# Altium schematic sheet mainboard.SchDoc
size A3; Organization: Altium Limited; Address1: L3, 12a Rodborough Rd; Address2: Frenchs Forest; Address3: NSW; Address4: Australia 2086
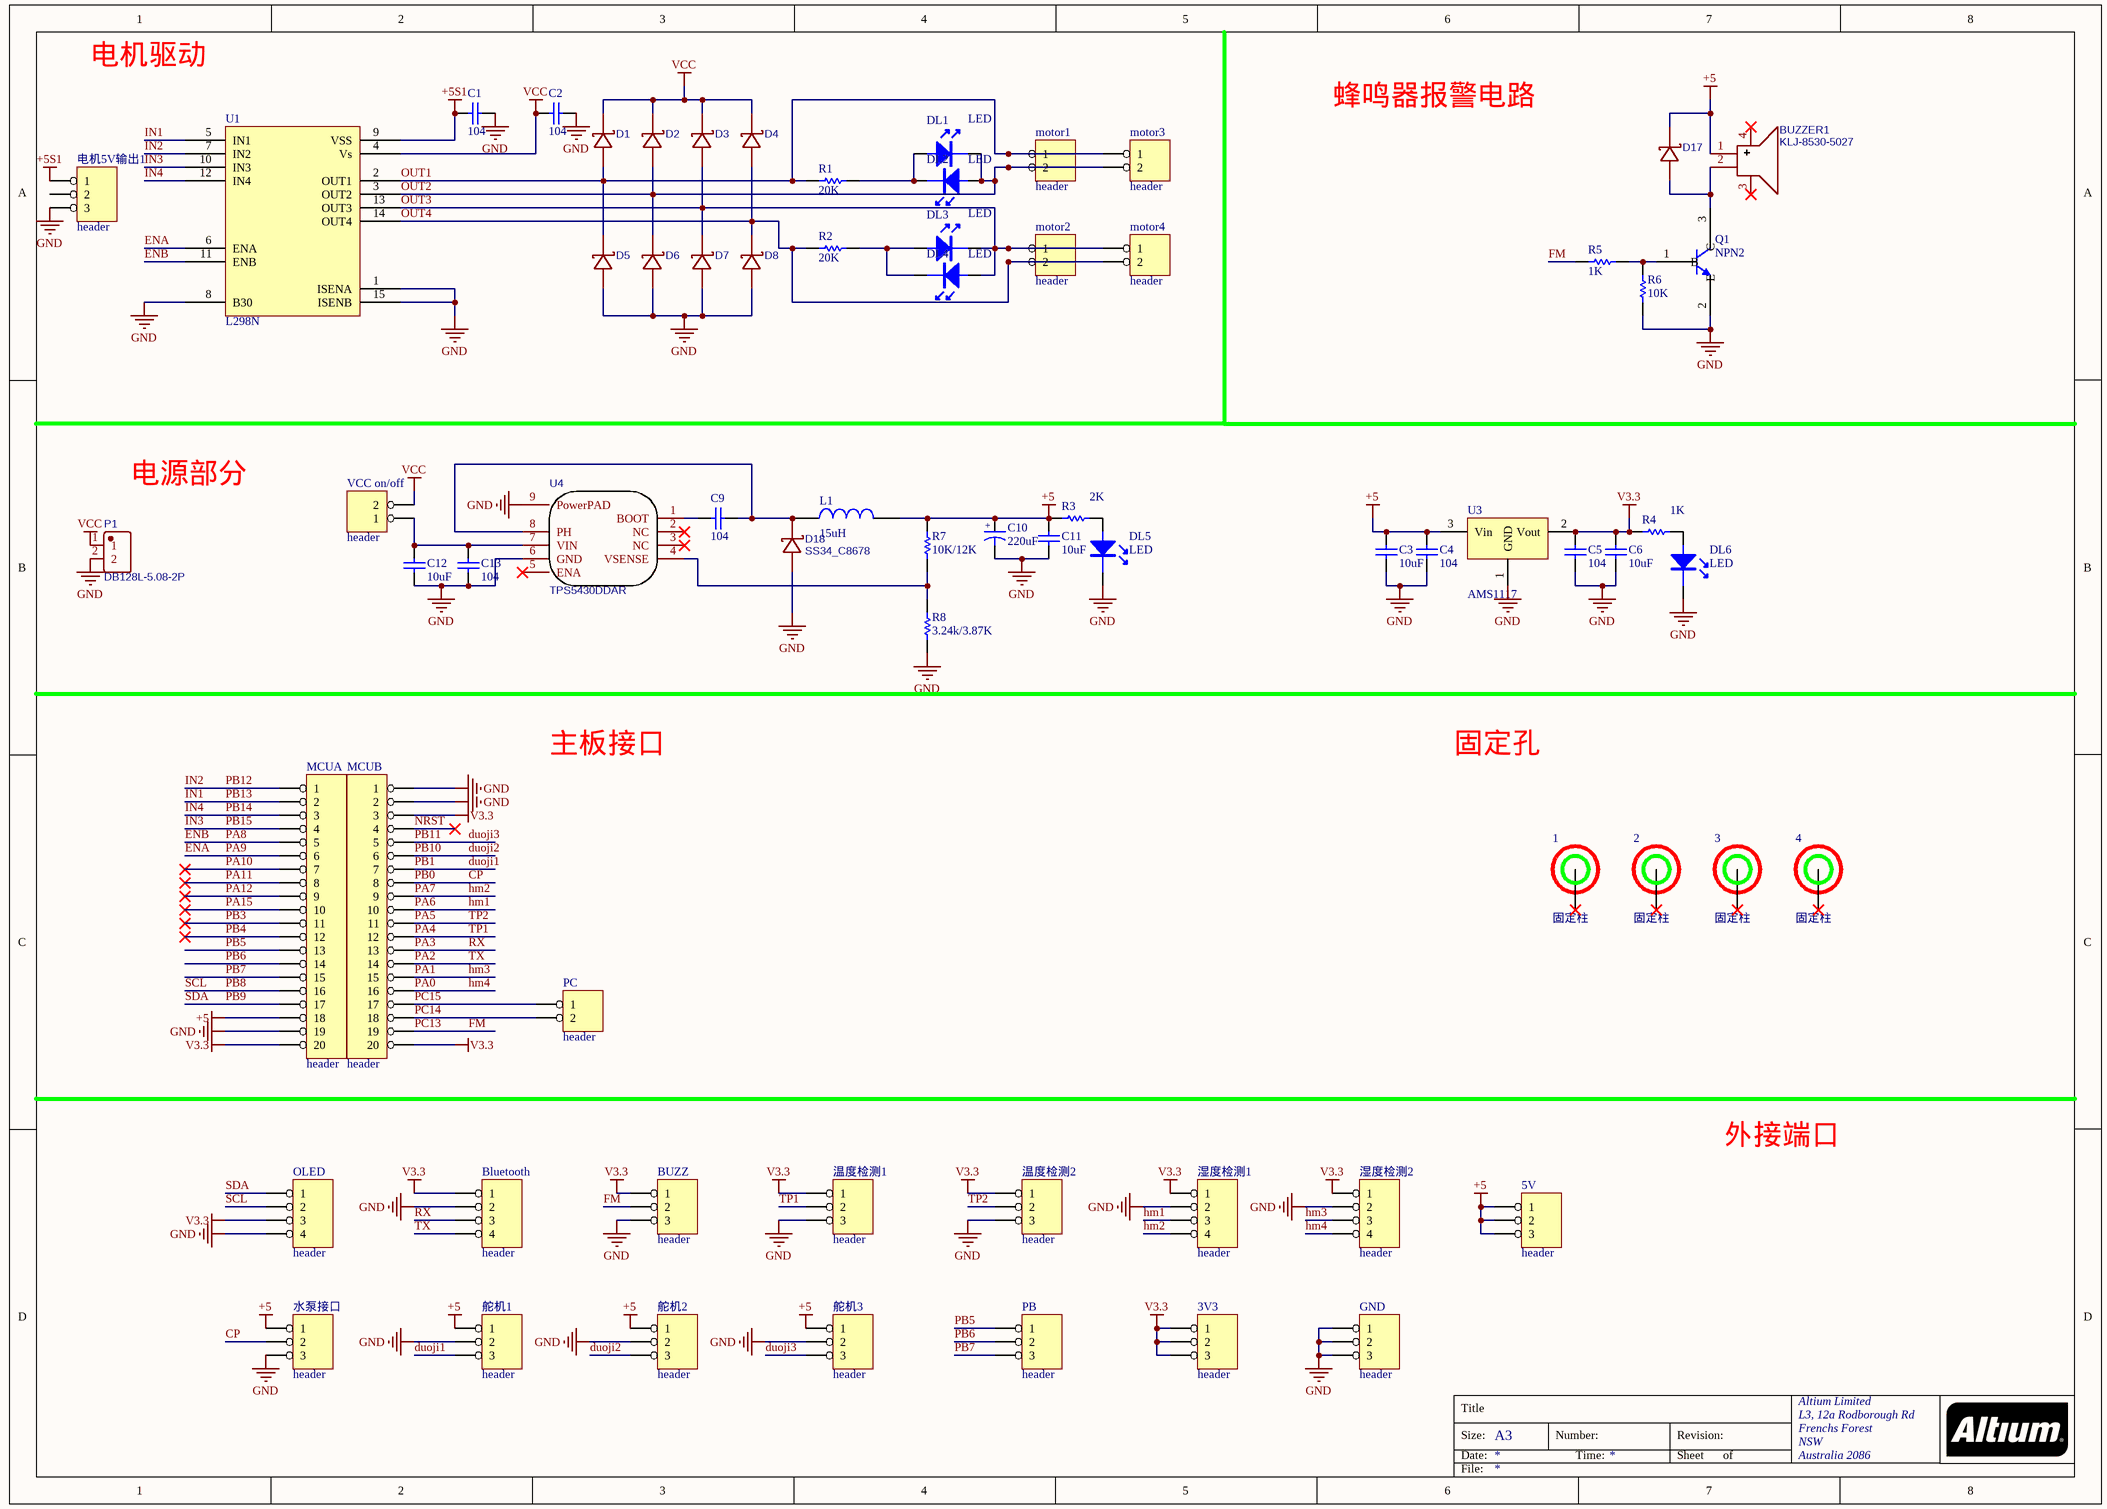
[diagram p0: mainboard.SchDoc]

## Parts
1  固定柱  [M3x4+6_L]
2  固定柱  [M3x4+6_L]
3  固定柱  [M3x4+6_L]
3V3  header  [header3]
4  固定柱  [M3x4+6_L]
5V  header  [header3]
Bluetooth  header  [header4]
BUZZ  header  [header3]
BUZZER1  KLJ-8530-5027  [BUZ-SMD_4P-L8.5-W8.5-TL]
C1  104  [0603_C]
C2  104  [0603_C]
C3  10uF  [0603_C]
C4  104  [0603_C]
C5  104  [0603_C]
C6  10uF  [0603_C]
C9  104  [0603_C]
C10  220uF  [CD7]
C11  10uF  [0805_c]
C12  10uF  [0805_c]
C13  104  [0603_C]
D1  (no value)  [DO-214AC_L4.3-W2.7-LS5.3-RD]
D2  (no value)  [DO-214AC_L4.3-W2.7-LS5.3-RD]
D3  (no value)  [DO-214AC_L4.3-W2.7-LS5.3-RD]
D4  (no value)  [DO-214AC_L4.3-W2.7-LS5.3-RD]
D5  (no value)  [DO-214AC_L4.3-W2.7-LS5.3-RD]
D6  (no value)  [DO-214AC_L4.3-W2.7-LS5.3-RD]
D7  (no value)  [DO-214AC_L4.3-W2.7-LS5.3-RD]
D8  (no value)  [DO-214AC_L4.3-W2.7-LS5.3-RD]
D17  (no value)  [DO-214AC_L4.3-W2.7-LS5.3-RD]
D18  SS34_C8678  [DO-214AC_L4.3-W2.7-LS5.3-RD]
DL1  LED  [0805_LED]
DL2  LED  [0805_LED]
DL3  LED  [0805_LED]
DL4  LED  [0805_LED]
DL5  LED  [0805_LED]
DL6  LED  [0805_LED]
GND  header  [header3]
L1  15uH  [CD75]
MCUA  header  [header20]
MCUB  header  [header20]
motor1  header  [header2]
motor2  header  [header2]
motor3  header  [header2]
motor4  header  [header2]
OLED  header  [header4]
P1  DB128L-5.08-2P  [CONN-TH_2P-P5.08_DB128L-5.08-2P]
PB  header  [header3]
PC  header  [header2]
Q1  NPN2  [SOT-23-3]
R1  20K  [0603_R]
R2  20K  [0603_R]
R3  2K  [0805_r]
R4  1K  [0805_r]
R5  1K  [0805_r]
R6  10K  [0805_r]
R7  10K/12K  [0805_r]
R8  3.24k/3.87K  [0805_r]
U1  L298N  [L298N]
U3  AMS1117  [SOT-223]
U4  TPS5430DDAR  [SOIC-8_L5.0-W4.0-P1.27-LS6.0-BL-EP]
VCC_on/off  header  [header2]
水泵接口  header  [header3]
温度检测1  header  [header3]
温度检测2  header  [header3]
湿度检测1  header  [header4]
湿度检测2  header  [header4]
电机5V输出1  header  [header3]
舵机1  header  [header3]
舵机2  header  [header3]
舵机3  header  [header3]

## Nets
+5: 5V.1 5V.2 5V.3 BUZZER1.1(+) C3.2 C4.2 C10.1 C11.2 D17.1(K) L1.2 MCUA.18 R3.2 R7.2 U3.3(Vin) 水泵接口.1 舵机1.1 舵机2.1 舵机3.1
+5S1: C1.1 U1.9(VSS) 电机5V输出1.1
GND: Bluetooth.2 BUZZ.3 C1.2 C2.2 C3.1 C4.1 C5.1 C6.1 C10.2 C11.1 C12.1 C13.1 D5.2(A) D6.2(A) D7.2(A) D8.2(A) D18.2(A) DL5.2(K) DL6.2(K) GND.1 GND.2 GND.3 MCUA.19 MCUB.1 MCUB.2 OLED.4 P1.2 Q1.2(E) R6.1 R8.1 U1.1(ISENA) U1.8(B30) U1.15(ISENB) U3.1(GND) U4.6(GND) U4.9(PowerPAD) 水泵接口.3 温度检测1.3 温度检测2.3 湿度检测1.2 湿度检测2.2 电机5V输出1.3 舵机1.2 舵机2.2 舵机3.2
V3.3: 3V3.1 3V3.2 3V3.3 Bluetooth.1 BUZZ.1 C5.2 C6.2 MCUA.20 MCUB.3 MCUB.20 OLED.3 R4.2 U3.2(Vout) 温度检测1.1 温度检测2.1 湿度检测1.1 湿度检测2.1
VCC: C2.1 D1.1(K) D2.1(K) D3.1(K) D4.1(K) P1.1 U1.4(Vs) VCC_on/off.2
CP: MCUB.8 水泵接口.2  [also labelled PB0]
duoji1: MCUB.7 舵机1.3  [also labelled PB1]
duoji2: MCUB.6 舵机2.3  [also labelled PB10]
duoji3: MCUB.5 舵机3.3  [also labelled PB11]
ENA: MCUA.6 U1.6(ENA)  [also labelled PA9]
ENB: MCUA.5 U1.11(ENB)  [also labelled PA8]
FM: BUZZ.2 MCUB.19 R5.1  [also labelled PC13]
hm1: MCUB.10 湿度检测1.3  [also labelled PA6]
hm2: MCUB.9 湿度检测1.4  [also labelled PA7]
hm3: MCUB.15 湿度检测2.3  [also labelled PA1]
hm4: MCUB.16 湿度检测2.4  [also labelled PA0]
IN1: MCUA.2 U1.5(IN1)  [also labelled PB13]
IN2: MCUA.1 U1.7(IN2)  [also labelled PB12]
IN3: MCUA.4 U1.10(IN3)  [also labelled PB15]
IN4: MCUA.3 U1.12(IN4)  [also labelled PB14]
NRST: MCUB.4
OUT1: D1.2(A) D5.1(K) motor1.1 motor3.1 R1.1 U1.2(OUT1)
OUT2: D2.2(A) D6.1(K) DL1.2(K) DL2.1(A) motor1.2 motor3.2 U1.3(OUT2)
OUT3: D3.2(A) D7.1(K) DL3.2(K) DL4.1(A) motor2.1 motor4.1 U1.13(OUT3)
OUT4: D4.2(A) D8.1(K) motor2.2 motor4.2 R2.1 U1.14(OUT4)
PA2: Bluetooth.4 MCUB.14  [also labelled TX]
PA3: Bluetooth.3 MCUB.13  [also labelled RX]
PA4: MCUB.12 温度检测1.2  [also labelled TP1]
PA5: MCUB.11 温度检测2.2  [also labelled TP2]
PA10: MCUA.7
PA11: MCUA.8
PA12: MCUA.9
PA15: MCUA.10
PB3: MCUA.11
PB4: MCUA.12
PB5: MCUA.13 PB.1
PB6: MCUA.14 PB.2
PB7: MCUA.15 PB.3
PB8: MCUA.16 OLED.2  [also labelled SCL]
PB9: MCUA.17 OLED.1  [also labelled SDA]
PC14: MCUB.18 PC.2
PC15: MCUB.17 PC.1
NetBUZZER1_2: BUZZER1.2(-) D17.2(A) Q1.3(C)
NetC9_1: C9.1 D18.1(K) L1.1 U4.8(PH)
NetC9_2: C9.2 U4.1(BOOT)
NetC12_2: C12.2 C13.2 U4.7(VIN) VCC_on/off.1
NetDL1_1: DL1.1(A) DL2.2(K) R1.2
NetDL3_1: DL3.1(A) DL4.2(K) R2.2
NetDL5_1: DL5.1(A) R3.1
NetDL6_1: DL6.1(A) R4.1
NetQ1_1: Q1.1(B) R5.2 R6.2
NetR7_1: R7.1 R8.2 U4.4(VSENSE)

Not connected (* = marked no-connect by the designer): 1 1*; 2 1*; 3 1*; 4 1*; BUZZER1 3(NC)* 4(NC)*; U4 2(NC)* 3(NC)* 5(ENA)*; 电机5V输出1 2

## Notes on the sheet
- 电机驱动
- 蜂鸣器报警电路
- 电源部分
- 主板接口
- 固定孔
- 外接端口
- Title
- Size:
- Date:
- A3
- Number:
- Time:
- Revision:
- Sheet
- of
- File:
- (in symbol CAP1) +

## Library data of the parts
1-4 = M3*10 固定柱
3V3 5V BUZZ GND PB 水泵接口 温度检测1 温度检测2 电机5V输出1 舵机1-舵机3 = HEADER 3
Bluetooth OLED 湿度检测1 湿度检测2 = HEADER 4
BUZZER1 = BUZZ: BOM_Manufacturer: KELIKING; Contributor: LCSC; BOM_Supplier: LCSC; BOM_Supplier Part: C556938; BOM_Manufacturer Part: KLJ-8530-5027; spicePre: B; spiceSymbolName: KLJ-8530-5027
C1 C2 C4 C5 C9 C13 = CAP: Capacitor; Published: 8-Jun-2000; LatestRevisionDate: 17-Jul-2002; LatestRevisionNote: Re-released for DXP Platform.; PackageReference: RAD-0.3; Publisher: Altium Limited; Value: 104
C3 C6 C11 C12 = CAP: Capacitor; Value: 104; Published: 8-Jun-2000; LatestRevisionDate: 17-Jul-2002; LatestRevisionNote: Re-released for DXP Platform.; PackageReference: RAD-0.3; Publisher: Altium Limited
C10 = CAP1
D1-D8 D17 D18 = SS34_C8678: BOM_Manufacturer Part: SS34; BOM_Manufacturer: MDD; SMT Type: Basic; BOM_Supplier: LCSC; image: //image.lceda.cn/szlcsc/C8678.jpg; BOM_Supplier Part: C8678; BOM_LCSC Assembly: Yes; spicePre: D; spiceSymbolName: SS34_C8678
DL1-DL6 = LED: LED 发光二极管
L1 = INDUCTOR
MCUA MCUB = HEADER 20
motor1-motor4 PC VCC_on/off = HEADER 2
P1 = duanzi-5.08-2P: BOM_Manufacturer: DIBO; Contributor: LCSC; BOM_Supplier: LCSC; BOM_Supplier Part: C395868; BOM_Manufacturer Part: DB128L-5.08-2P; spicePre: U; spiceSymbolName: DB128L-5.08-2P
Q1 = NPN2: 贴片
R1-R3 R6-R8 = RES: Resistor; Value: 1K; Published: 8-Jun-2000; Revision: July-2002: Re-released for DXP Platform.; Publisher: Altium Limited
R4 R5 = RES: Resistor; Published: 8-Jun-2000; Revision: July-2002: Re-released for DXP Platform.; Publisher: Altium Limited; Value: 1K
U3 = AMS1117: 3.3V电压转换器AMS1117
U4 = TPS5430DDAR: BOM_Manufacturer: TI; SMT Type: Basic; BOM_Supplier: LCSC; BOM_Manufacturer Part: TPS5430DDAR; BOM_LCSC Assembly: Yes; image: //image.lceda.cn/szlcsc/C9864.jpg; BOM_Supplier Part: C9864; spicePre: U; spiceSymbolName: TPS5430DDAR